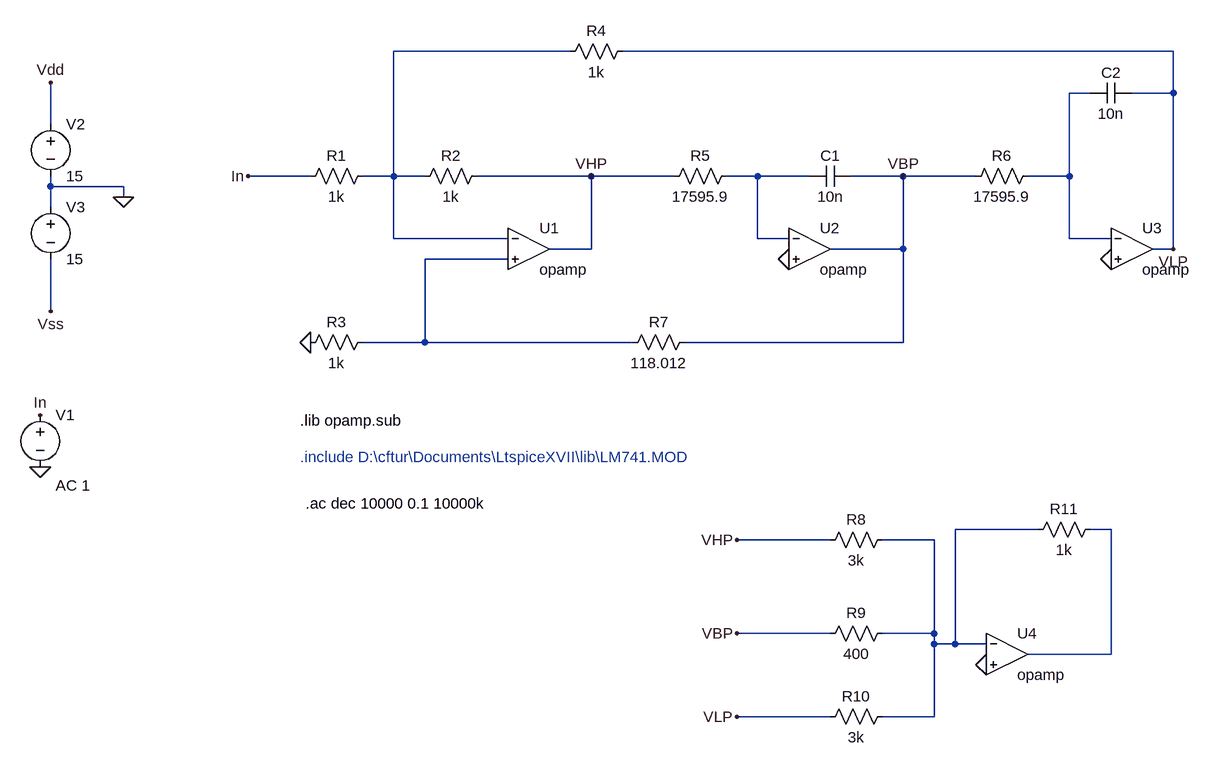
[diagram p0: schematic KHN.asc]
KHN.asc, the LTspice schematic file:
Version 4
SHEET 1 1264 956
WIRE 256 -128 -16 -128
WIRE 1184 -128 336 -128
WIRE 1056 -64 1024 -64
WIRE 1184 -64 1184 -128
WIRE 1184 -64 1120 -64
WIRE -544 -16 -544 -80
WIRE -144 64 -240 64
WIRE -16 64 -16 -128
WIRE -16 64 -64 64
WIRE 32 64 -16 64
WIRE 288 64 112 64
WIRE 416 64 288 64
WIRE 544 64 496 64
WIRE 624 64 544 64
WIRE 768 64 688 64
WIRE 880 64 768 64
WIRE 1024 64 1024 -64
WIRE 1024 64 960 64
WIRE -544 80 -544 64
WIRE -432 80 -544 80
WIRE -432 96 -432 80
WIRE -544 112 -544 80
WIRE -16 160 -16 64
WIRE 160 160 -16 160
WIRE 544 160 544 64
WIRE 592 160 544 160
WIRE 1024 160 1024 64
WIRE 1088 160 1024 160
WIRE 288 176 288 64
WIRE 288 176 224 176
WIRE 768 176 768 64
WIRE 768 176 656 176
WIRE 1184 176 1184 -64
WIRE 1184 176 1152 176
WIRE 160 192 32 192
WIRE -544 272 -544 192
WIRE 32 320 32 192
WIRE 32 320 -64 320
WIRE 352 320 32 320
WIRE 768 320 768 176
WIRE 768 320 432 320
WIRE 976 608 848 608
WIRE 1088 608 1056 608
WIRE 656 624 512 624
WIRE 816 624 736 624
WIRE 656 768 512 768
WIRE 816 768 816 624
WIRE 816 768 736 768
WIRE 816 784 816 768
WIRE 848 784 848 608
WIRE 848 784 816 784
WIRE 896 784 848 784
WIRE 1088 800 1088 608
WIRE 1088 800 960 800
WIRE 656 896 512 896
WIRE 816 896 816 784
WIRE 816 896 736 896
FLAG -144 320 0
FLAG -240 64 In
FLAG -560 432 In
FLAG -560 512 0
FLAG -432 96 0
FLAG -544 -80 Vdd
FLAG -544 272 Vss
FLAG 288 64 VHP
FLAG 768 64 VBP
FLAG 1184 176 VLP
FLAG 512 624 VHP
FLAG 512 768 VBP
FLAG 512 896 VLP
FLAG 592 192 0
FLAG 1088 192 0
FLAG 896 816 0
SYMBOL res -48 48 R90
WINDOW 0 0 56 VBottom 2
WINDOW 3 32 56 VTop 2
SYMATTR InstName R1
SYMATTR Value 1k
SYMBOL res 128 48 R90
WINDOW 0 0 56 VBottom 2
WINDOW 3 32 56 VTop 2
SYMATTR InstName R2
SYMATTR Value 1k
SYMBOL res -48 304 R90
WINDOW 0 0 56 VBottom 2
WINDOW 3 32 56 VTop 2
SYMATTR InstName R3
SYMATTR Value 1k
SYMBOL res 352 -144 R90
WINDOW 0 0 56 VBottom 2
WINDOW 3 32 56 VTop 2
SYMATTR InstName R4
SYMATTR Value 1k
SYMBOL res 512 48 R90
WINDOW 0 0 56 VBottom 2
WINDOW 3 32 56 VTop 2
SYMATTR InstName R5
SYMATTR Value 17595.9
SYMBOL res 976 48 R90
WINDOW 0 0 56 VBottom 2
WINDOW 3 32 56 VTop 2
SYMATTR InstName R6
SYMATTR Value 17595.9
SYMBOL res 448 304 R90
WINDOW 0 0 56 VBottom 2
WINDOW 3 32 56 VTop 2
SYMATTR InstName R7
SYMATTR Value 118.012
SYMBOL cap 688 48 R90
WINDOW 0 0 32 VBottom 2
WINDOW 3 32 32 VTop 2
SYMATTR InstName C1
SYMATTR Value 10n
SYMBOL cap 1120 -80 R90
WINDOW 0 0 32 VBottom 2
WINDOW 3 32 32 VTop 2
SYMATTR InstName C2
SYMATTR Value 10n
SYMBOL voltage -560 416 R0
WINDOW 123 24 124 Left 2
WINDOW 39 0 0 Left 0
SYMATTR Value2 AC 1
SYMATTR InstName V1
SYMATTR Value ""
SYMBOL voltage -544 -32 R0
WINDOW 123 0 0 Left 0
WINDOW 39 0 0 Left 0
SYMATTR InstName V2
SYMATTR Value 15
SYMBOL voltage -544 96 R0
WINDOW 123 0 0 Left 0
WINDOW 39 0 0 Left 0
SYMATTR InstName V3
SYMATTR Value 15
SYMBOL res 752 608 R90
WINDOW 0 0 56 VBottom 2
WINDOW 3 32 56 VTop 2
SYMATTR InstName R8
SYMATTR Value 3k
SYMBOL res 752 752 R90
WINDOW 0 0 56 VBottom 2
WINDOW 3 32 56 VTop 2
SYMATTR InstName R9
SYMATTR Value 400
SYMBOL res 752 880 R90
WINDOW 0 0 56 VBottom 2
WINDOW 3 32 56 VTop 2
SYMATTR InstName R10
SYMATTR Value 3k
SYMBOL res 1072 592 R90
WINDOW 0 0 56 VBottom 2
WINDOW 3 32 56 VTop 2
SYMATTR InstName R11
SYMATTR Value 1k
SYMBOL Opamps\\opamp 192 112 R0
SYMATTR InstName U1
SYMBOL Opamps\\opamp 624 112 R0
SYMATTR InstName U2
SYMBOL Opamps\\opamp 1120 112 R0
SYMATTR InstName U3
SYMBOL Opamps\\opamp 928 736 R0
SYMATTR InstName U4
TEXT -160 496 Left 2 ;.include D:\\cftur\\Documents\\LtspiceXVII\\lib\\LM741.MOD
TEXT -152 568 Left 2 !.ac dec 10000 0.1 10000k
TEXT -160 440 Left 2 !.lib opamp.sub

The netlist it stands for:
* KHN.asc
R1 N001 In 1k
R2 VHP N001 1k
R3 N004 0 1k
R4 VLP N001 1k
R5 N003 VHP 17595.9
R6 N002 VBP 17595.9
R7 VBP N004 118.012
C1 VBP N003 10n
C2 VLP N002 10n
V1 In 0 AC 1
V2 Vdd 0 15
V3 0 Vss 15
R8 N005 VHP 3k
R9 N005 VBP 400
R10 N005 VLP 3k
R11 N006 N005 1k
XU1 N001 N004 VHP opamp Aol=100K GBW=10Meg  ; pins invin noninvin out
XU2 N003 0 VBP opamp Aol=100K GBW=10Meg  ; pins invin noninvin out
XU3 N002 0 VLP opamp Aol=100K GBW=10Meg  ; pins invin noninvin out
XU4 N005 0 N006 opamp Aol=100K GBW=10Meg  ; pins invin noninvin out
* .include D:\cftur\Documents\LtspiceXVII\lib\LM741.MOD
.ac dec 10000 0.1 10000k
.lib opamp.sub
.backanno
.end